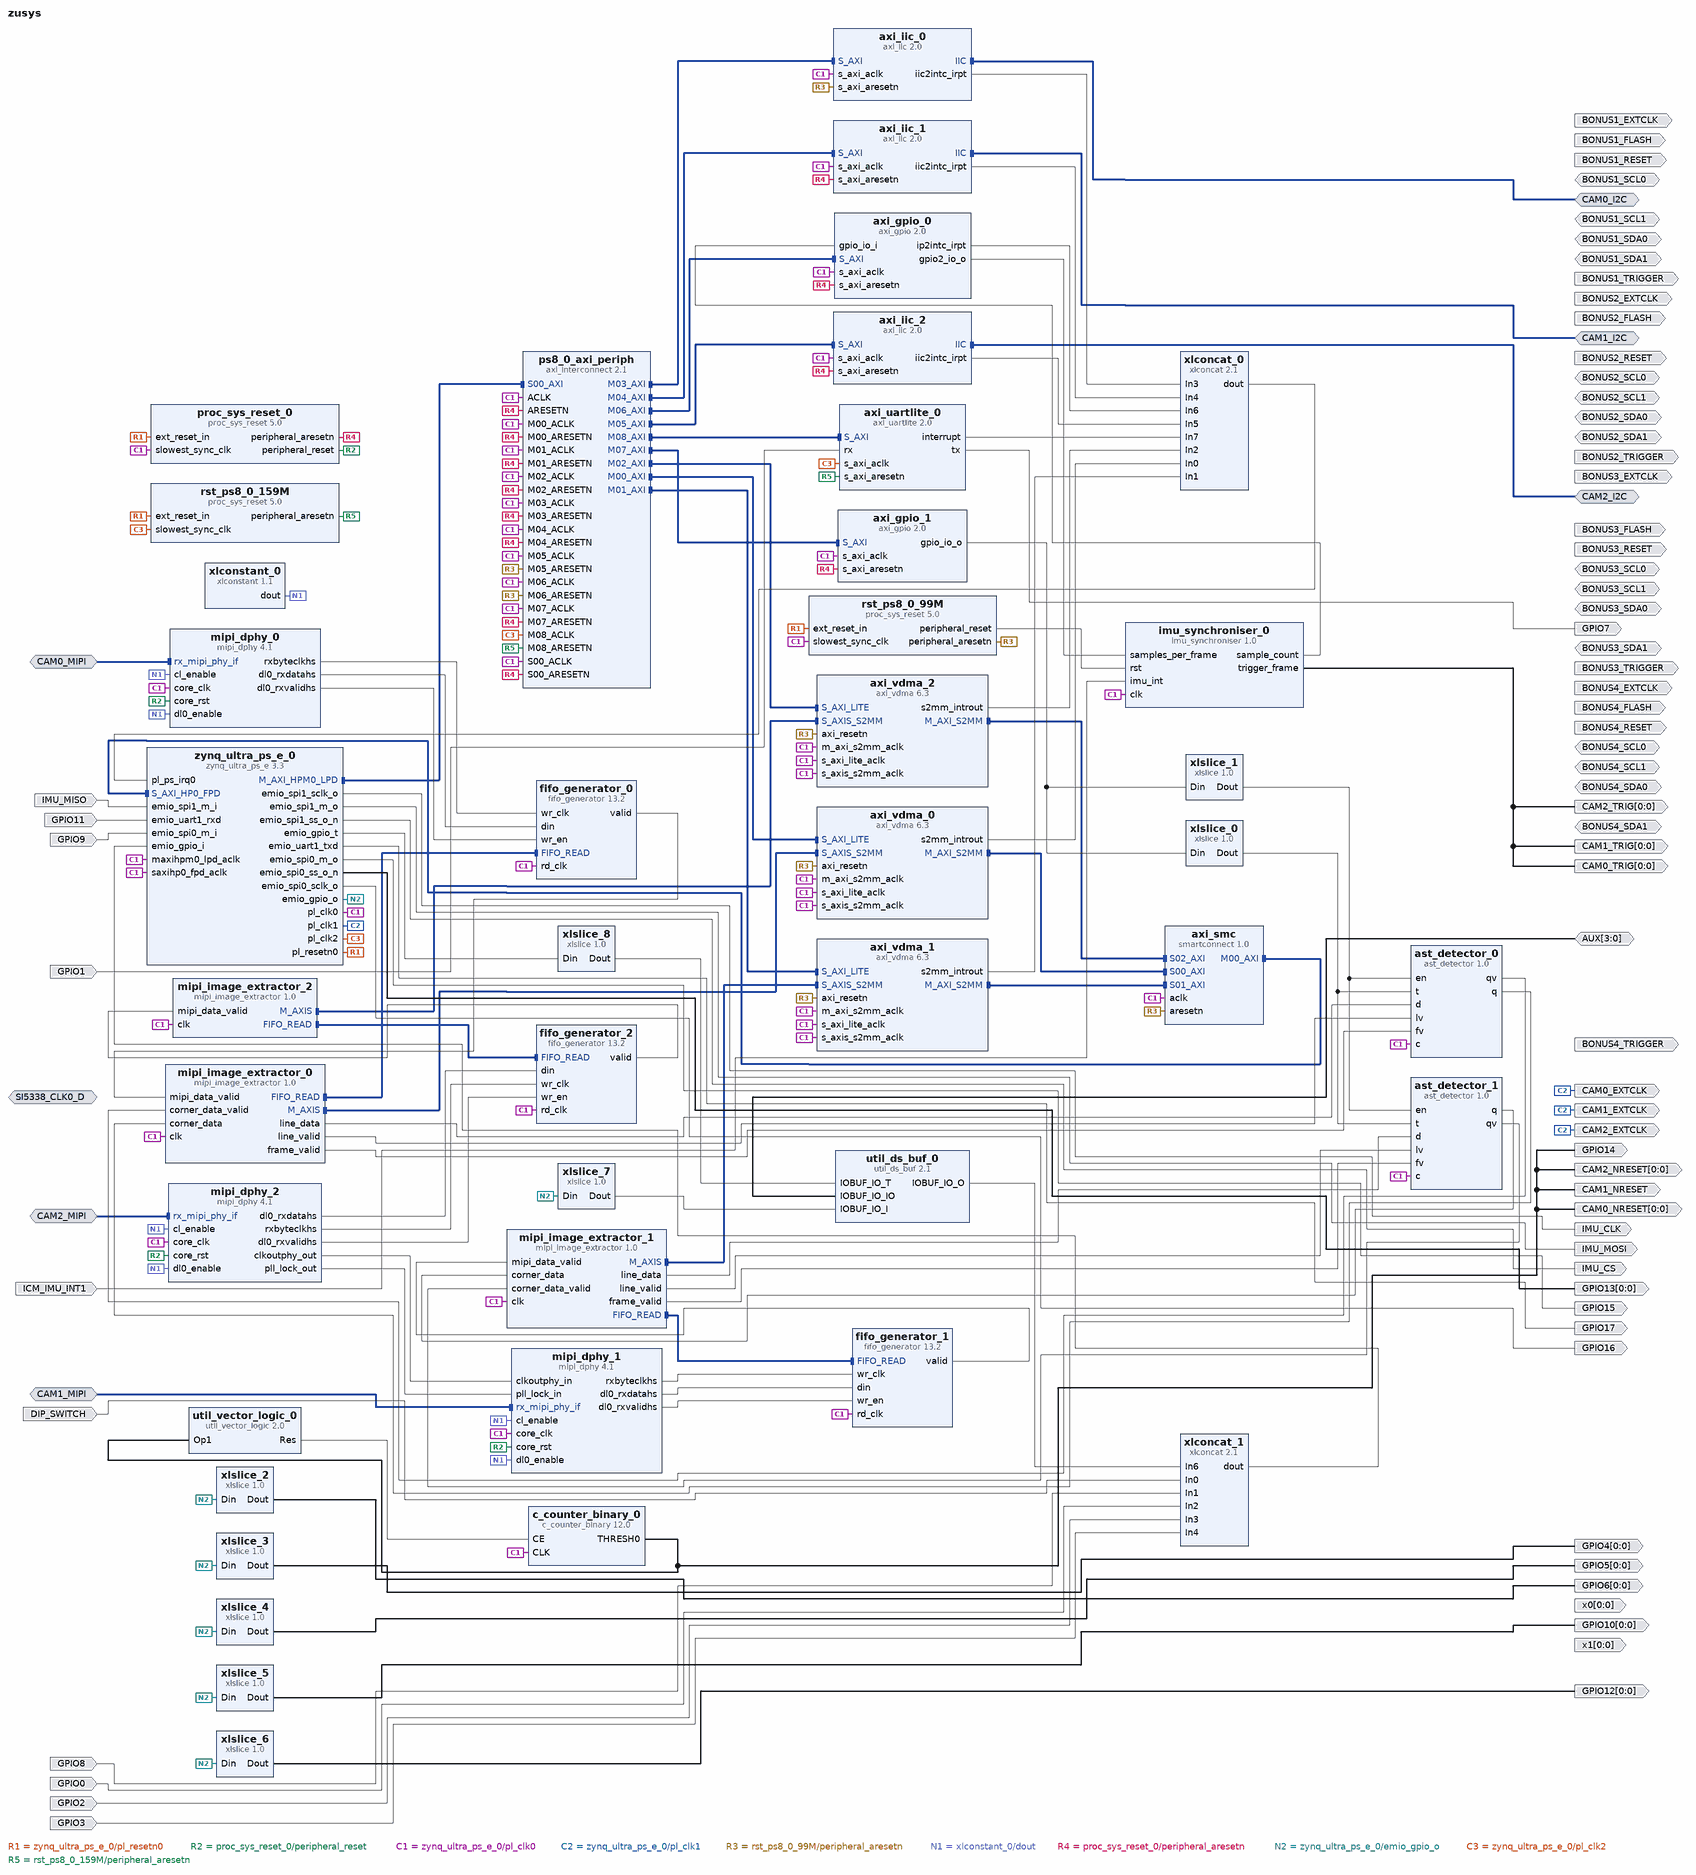
[diagram p0: block diagram of the top level]
# Vivado block design zusys, xczu3eg-sfvc784-1-e, Vivado 2019.1
create_bd_design zusys

create_bd_intf_port -mode Slave -vlnv xilinx.com:interface:diff_clock_rtl:1.0 SI5338_CLK0_D
create_bd_intf_port -mode Master -vlnv xilinx.com:interface:iic_rtl:1.0 CAM0_I2C
create_bd_intf_port -mode Master -vlnv xilinx.com:interface:iic_rtl:1.0 CAM1_I2C
create_bd_intf_port -mode Master -vlnv xilinx.com:interface:iic_rtl:1.0 CAM2_I2C
create_bd_intf_port -mode Slave -vlnv xilinx.com:interface:mipi_phy_rtl:1.0 CAM0_MIPI
create_bd_intf_port -mode Slave -vlnv xilinx.com:interface:mipi_phy_rtl:1.0 CAM1_MIPI
create_bd_intf_port -mode Slave -vlnv xilinx.com:interface:mipi_phy_rtl:1.0 CAM2_MIPI
create_bd_port -dir O -from 0 -to 0 CAM1_TRIG
create_bd_port -dir O CAM1_NRESET
create_bd_port -dir O CAM1_EXTCLK
create_bd_port -dir O -from 0 -to 0 CAM2_NRESET
create_bd_port -dir O CAM2_EXTCLK
create_bd_port -dir O -from 0 -to 0 CAM2_TRIG
create_bd_port -dir O BONUS2_TRIGGER
create_bd_port -dir O BONUS2_RESET
create_bd_port -dir O BONUS2_FLASH
create_bd_port -dir IO BONUS2_SDA1
create_bd_port -dir IO BONUS2_SCL1
create_bd_port -dir IO BONUS2_SDA0
create_bd_port -dir IO BONUS2_SCL0
create_bd_port -dir O BONUS2_EXTCLK
create_bd_port -dir O BONUS1_FLASH
create_bd_port -dir O BONUS1_RESET
create_bd_port -dir I ICM_IMU_INT1
create_bd_port -dir O BONUS1_TRIGGER
create_bd_port -dir O BONUS1_EXTCLK
create_bd_port -dir IO BONUS1_SCL0
create_bd_port -dir IO BONUS1_SDA0
create_bd_port -dir IO BONUS1_SCL1
create_bd_port -dir IO BONUS1_SDA1
create_bd_port -dir O BONUS4_RESET
create_bd_port -dir O BONUS4_TRIGGER
create_bd_port -dir O BONUS4_EXTCLK
create_bd_port -dir O CAM0_EXTCLK
create_bd_port -dir O -from 0 -to 0 CAM0_NRESET
create_bd_port -dir O -from 0 -to 0 CAM0_TRIG
create_bd_port -dir O BONUS3_EXTCLK
create_bd_port -dir IO BONUS3_SCL0
create_bd_port -dir IO BONUS3_SDA0
create_bd_port -dir IO BONUS3_SCL1
create_bd_port -dir IO BONUS3_SDA1
create_bd_port -dir O BONUS3_FLASH
create_bd_port -dir O BONUS3_RESET
create_bd_port -dir O BONUS3_TRIGGER
create_bd_port -dir O BONUS4_FLASH
create_bd_port -dir IO BONUS4_SDA0
create_bd_port -dir IO BONUS4_SDA1
create_bd_port -dir IO BONUS4_SCL0
create_bd_port -dir IO BONUS4_SCL1
create_bd_port -dir O -from 0 -to 0 GPIO4
create_bd_port -dir O -from 0 -to 0 GPIO5
create_bd_port -dir O -from 0 -to 0 GPIO6
create_bd_port -dir O GPIO7
create_bd_port -dir O -from 0 -to 0 GPIO10
create_bd_port -dir O -from 0 -to 0 GPIO12
create_bd_port -dir O -from 0 -to 0 GPIO13
create_bd_port -dir O GPIO14
create_bd_port -dir O GPIO15
create_bd_port -dir O GPIO16
create_bd_port -dir O GPIO17
create_bd_port -dir O IMU_MOSI
create_bd_port -dir O IMU_CS
create_bd_port -dir O IMU_CLK
create_bd_port -dir I IMU_MISO
create_bd_port -dir I DIP_SWITCH
create_bd_port -dir I GPIO8
create_bd_port -dir I GPIO9
create_bd_port -dir I GPIO11
create_bd_port -dir I GPIO0
create_bd_port -dir I GPIO1
create_bd_port -dir I GPIO2
create_bd_port -dir I GPIO3
create_bd_port -dir O -from 0 -to 0 x0
create_bd_port -dir O -from 0 -to 0 x1
create_bd_port -dir IO -from 3 -to 0 AUX

create_bd_cell -type ip -vlnv xilinx.com:ip:proc_sys_reset:5.0 rst_ps8_0_99M
create_bd_cell -type ip -vlnv xilinx.com:ip:proc_sys_reset:5.0 proc_sys_reset_0
create_bd_cell -type ip -vlnv xilinx.com:ip:util_vector_logic:2.0 util_vector_logic_0
set_property -dict {CONFIG.C_OPERATION not CONFIG.C_SIZE 1} [get_bd_cells util_vector_logic_0]
create_bd_cell -type ip -vlnv xilinx.com:ip:axi_gpio:2.0 axi_gpio_0
set_property -dict [list \
  CONFIG.C_ALL_INPUTS 1 \
  CONFIG.C_ALL_INPUTS_2 0 \
  CONFIG.C_ALL_OUTPUTS_2 1 \
  CONFIG.C_DOUT_DEFAULT_2 0x00000007 \
  CONFIG.C_GPIO2_WIDTH 8 \
  CONFIG.C_GPIO_WIDTH 8 \
  CONFIG.C_INTERRUPT_PRESENT 1 \
  CONFIG.C_IS_DUAL 1 \
] [get_bd_cells axi_gpio_0]
create_bd_cell -type ip -vlnv xilinx.com:ip:axi_iic:2.0 axi_iic_0
set_property -dict [list \
  CONFIG.C_SCL_INERTIAL_DELAY 20 \
  CONFIG.C_SDA_INERTIAL_DELAY 20 \
  CONFIG.IIC_FREQ_KHZ 400 \
] [get_bd_cells axi_iic_0]
create_bd_cell -type ip -vlnv xilinx.com:ip:axi_iic:2.0 axi_iic_1
set_property -dict [list \
  CONFIG.C_SCL_INERTIAL_DELAY 20 \
  CONFIG.C_SDA_INERTIAL_DELAY 20 \
  CONFIG.IIC_FREQ_KHZ 400 \
] [get_bd_cells axi_iic_1]
create_bd_cell -type ip -vlnv xilinx.com:ip:axi_iic:2.0 axi_iic_2
set_property -dict [list \
  CONFIG.C_SCL_INERTIAL_DELAY 20 \
  CONFIG.C_SDA_INERTIAL_DELAY 20 \
  CONFIG.IIC_FREQ_KHZ 400 \
] [get_bd_cells axi_iic_2]
create_bd_cell -type ip -vlnv xilinx.com:ip:smartconnect:1.0 axi_smc
set_property -dict {CONFIG.NUM_MI 1 CONFIG.NUM_SI 3} [get_bd_cells axi_smc]
create_bd_cell -type ip -vlnv xilinx.com:ip:axi_vdma:6.3 axi_vdma_0
set_property -dict [list \
  CONFIG.c_include_mm2s 0 \
  CONFIG.c_include_s2mm 1 \
  CONFIG.c_include_s2mm_dre 0 \
  CONFIG.c_num_fstores 3 \
  CONFIG.c_s2mm_genlock_mode 0 \
  CONFIG.c_s2mm_max_burst_length 8 \
  CONFIG.c_use_s2mm_fsync 0 \
] [get_bd_cells axi_vdma_0]
create_bd_cell -type ip -vlnv xilinx.com:ip:axi_vdma:6.3 axi_vdma_1
set_property -dict [list \
  CONFIG.c_include_mm2s 0 \
  CONFIG.c_include_s2mm 1 \
  CONFIG.c_include_s2mm_dre 0 \
  CONFIG.c_num_fstores 3 \
  CONFIG.c_s2mm_genlock_mode 0 \
  CONFIG.c_s2mm_max_burst_length 8 \
  CONFIG.c_use_s2mm_fsync 0 \
] [get_bd_cells axi_vdma_1]
create_bd_cell -type ip -vlnv xilinx.com:ip:axi_vdma:6.3 axi_vdma_2
set_property -dict [list \
  CONFIG.c_include_mm2s 0 \
  CONFIG.c_include_s2mm 1 \
  CONFIG.c_include_s2mm_dre 0 \
  CONFIG.c_num_fstores 3 \
  CONFIG.c_s2mm_genlock_mode 0 \
  CONFIG.c_s2mm_linebuffer_depth 128 \
  CONFIG.c_s2mm_max_burst_length 8 \
  CONFIG.c_use_s2mm_fsync 0 \
] [get_bd_cells axi_vdma_2]
create_bd_cell -type ip -vlnv xilinx.com:ip:c_counter_binary:12.0 c_counter_binary_0
set_property -dict [list \
  CONFIG.CE true \
  CONFIG.Final_Count_Value C3500 \
  CONFIG.Output_Width 20 \
  CONFIG.Restrict_Count true \
  CONFIG.Sync_Threshold_Output true \
  CONFIG.Threshold_Value C3500 \
] [get_bd_cells c_counter_binary_0]
create_bd_cell -type ip -vlnv xilinx.com:ip:fifo_generator:13.2 fifo_generator_0
set_property -dict [list \
  CONFIG.Fifo_Implementation Independent_Clocks_Distributed_RAM \
  CONFIG.Input_Data_Width 8 \
  CONFIG.Input_Depth 16 \
  CONFIG.Reset_Pin false \
  CONFIG.Valid_Flag true \
  CONFIG.synchronization_stages 3 \
] [get_bd_cells fifo_generator_0]
create_bd_cell -type ip -vlnv xilinx.com:ip:fifo_generator:13.2 fifo_generator_1
set_property -dict [list \
  CONFIG.Fifo_Implementation Independent_Clocks_Distributed_RAM \
  CONFIG.Input_Data_Width 8 \
  CONFIG.Input_Depth 16 \
  CONFIG.Reset_Pin false \
  CONFIG.Valid_Flag true \
  CONFIG.synchronization_stages 3 \
] [get_bd_cells fifo_generator_1]
create_bd_cell -type ip -vlnv xilinx.com:ip:fifo_generator:13.2 fifo_generator_2
set_property -dict [list \
  CONFIG.Fifo_Implementation Independent_Clocks_Distributed_RAM \
  CONFIG.Input_Data_Width 8 \
  CONFIG.Input_Depth 16 \
  CONFIG.Reset_Pin false \
  CONFIG.Valid_Flag true \
  CONFIG.synchronization_stages 3 \
] [get_bd_cells fifo_generator_2]
create_bd_cell -type ip -vlnv xilinx.com:ip:mipi_dphy:4.1 mipi_dphy_0
set_property -dict [list \
  CONFIG.CLK_LANE_IO_LOC AD5 \
  CONFIG.C_CLK_LANE_IO_POSITION 26 \
  CONFIG.C_DATA_LANE0_IO_POSITION 28 \
  CONFIG.C_DPHY_MODE SLAVE \
  CONFIG.C_EN_REG_IF false \
  CONFIG.C_HS_LINE_RATE 560 \
  CONFIG.C_HS_SETTLE_NS 152 \
  CONFIG.C_INIT 100000 \
  CONFIG.DATA_LANE0_IO_LOC AC4 \
  CONFIG.DATA_LANE0_TXIF2_BYTE All_Byte \
  CONFIG.DATA_LANE0_TXIF3_BYTE All_Byte \
  CONFIG.DATA_LANE0_TXIF4_BYTE All_Byte \
  CONFIG.SupportLevel 1 \
] [get_bd_cells mipi_dphy_0]
create_bd_cell -type ip -vlnv xilinx.com:ip:mipi_dphy:4.1 mipi_dphy_1
set_property -dict [list \
  CONFIG.CLK_LANE_IO_LOC G1 \
  CONFIG.C_CLK_LANE_IO_POSITION 0 \
  CONFIG.C_DATA_LANE0_IO_POSITION 2 \
  CONFIG.C_DPHY_MODE SLAVE \
  CONFIG.C_EN_REG_IF false \
  CONFIG.C_HS_LINE_RATE 560 \
  CONFIG.C_HS_SETTLE_NS 152 \
  CONFIG.C_INIT 100000 \
  CONFIG.C_TXIF1_INSTNAME tx66 \
  CONFIG.DATA_LANE0_IO_LOC E1 \
  CONFIG.DATA_LANE0_TXIF2_BYTE All_Byte \
  CONFIG.DATA_LANE0_TXIF3_BYTE All_Byte \
  CONFIG.DATA_LANE0_TXIF4_BYTE All_Byte \
  CONFIG.HP_IO_BANK_NAME {66_(HP)} \
  CONFIG.HP_IO_BANK_SELECTION 66 \
  CONFIG.SupportLevel 0 \
] [get_bd_cells mipi_dphy_1]
create_bd_cell -type ip -vlnv xilinx.com:ip:mipi_dphy:4.1 mipi_dphy_2
set_property -dict [list \
  CONFIG.CLK_LANE_IO_LOC B4 \
  CONFIG.C_CLK_LANE_IO_POSITION 19 \
  CONFIG.C_DATA_LANE0_IO_POSITION 21 \
  CONFIG.C_DPHY_MODE SLAVE \
  CONFIG.C_EN_REG_IF false \
  CONFIG.C_HS_LINE_RATE 560 \
  CONFIG.C_HS_SETTLE_NS 152 \
  CONFIG.C_INIT 100000 \
  CONFIG.C_TXIF1_INSTNAME tx66 \
  CONFIG.DATA_LANE0_IO_LOC D4 \
  CONFIG.DATA_LANE0_TXIF2_BYTE All_Byte \
  CONFIG.DATA_LANE0_TXIF3_BYTE All_Byte \
  CONFIG.DATA_LANE0_TXIF4_BYTE All_Byte \
  CONFIG.HP_IO_BANK_NAME {66_(HP)} \
  CONFIG.HP_IO_BANK_SELECTION 66 \
  CONFIG.SupportLevel 1 \
] [get_bd_cells mipi_dphy_2]
create_bd_cell -type ip -vlnv xilinx.com:ip:axi_interconnect:2.1 ps8_0_axi_periph
set_property -dict {CONFIG.NUM_MI 9} [get_bd_cells ps8_0_axi_periph]
create_bd_cell -type ip -vlnv xilinx.com:ip:xlconcat:2.1 xlconcat_0
set_property -dict {CONFIG.NUM_PORTS 8 CONFIG.dout_width 8} [get_bd_cells xlconcat_0]
create_bd_cell -type ip -vlnv xilinx.com:ip:xlconstant:1.1 xlconstant_0
create_bd_cell -type ip -vlnv xilinx.com:ip:zynq_ultra_ps_e:3.3 zynq_ultra_ps_e_0
set_property -dict [list \
  CONFIG.CAN0_BOARD_INTERFACE custom \
  CONFIG.CAN1_BOARD_INTERFACE custom \
  CONFIG.CSU_BOARD_INTERFACE custom \
  CONFIG.DP_BOARD_INTERFACE custom \
  CONFIG.GEM0_BOARD_INTERFACE custom \
  CONFIG.GEM1_BOARD_INTERFACE custom \
  CONFIG.GEM2_BOARD_INTERFACE custom \
  CONFIG.GEM3_BOARD_INTERFACE custom \
  CONFIG.GPIO_BOARD_INTERFACE custom \
  CONFIG.IIC0_BOARD_INTERFACE custom \
  CONFIG.IIC1_BOARD_INTERFACE custom \
  CONFIG.NAND_BOARD_INTERFACE custom \
  CONFIG.PCIE_BOARD_INTERFACE custom \
  CONFIG.PJTAG_BOARD_INTERFACE custom \
  CONFIG.PMU_BOARD_INTERFACE custom \
  CONFIG.PSU_BANK_0_IO_STANDARD LVCMOS18 \
  CONFIG.PSU_BANK_1_IO_STANDARD LVCMOS33 \
  CONFIG.PSU_BANK_2_IO_STANDARD LVCMOS18 \
  CONFIG.PSU_BANK_3_IO_STANDARD LVCMOS18 \
  CONFIG.PSU_USB3__DUAL_CLOCK_ENABLE 1 \
  CONFIG.PSU__CAN1__PERIPHERAL__ENABLE 0 \
  CONFIG.PSU__CRF_APB__ACPU_CTRL__FREQMHZ 1200 \
  CONFIG.PSU__CRF_APB__ACPU_CTRL__SRCSEL APLL \
  CONFIG.PSU__CRF_APB__APLL_CTRL__SRCSEL PSS_REF_CLK \
  CONFIG.PSU__CRF_APB__DBG_FPD_CTRL__FREQMHZ 250 \
  CONFIG.PSU__CRF_APB__DBG_FPD_CTRL__SRCSEL IOPLL \
  CONFIG.PSU__CRF_APB__DBG_TRACE_CTRL__FREQMHZ 250 \
  CONFIG.PSU__CRF_APB__DBG_TRACE_CTRL__SRCSEL IOPLL \
  CONFIG.PSU__CRF_APB__DBG_TSTMP_CTRL__FREQMHZ 250 \
  CONFIG.PSU__CRF_APB__DBG_TSTMP_CTRL__SRCSEL IOPLL \
  CONFIG.PSU__CRF_APB__DDR_CTRL__FREQMHZ 1200 \
  CONFIG.PSU__CRF_APB__DDR_CTRL__SRCSEL DPLL \
  CONFIG.PSU__CRF_APB__DPDMA_REF_CTRL__FREQMHZ 600 \
  CONFIG.PSU__CRF_APB__DPDMA_REF_CTRL__SRCSEL DPLL \
  CONFIG.PSU__CRF_APB__DPLL_CTRL__SRCSEL PSS_REF_CLK \
  CONFIG.PSU__CRF_APB__DP_AUDIO_REF_CTRL__SRCSEL VPLL \
  CONFIG.PSU__CRF_APB__DP_STC_REF_CTRL__SRCSEL VPLL \
  CONFIG.PSU__CRF_APB__DP_VIDEO_REF_CTRL__SRCSEL DPLL \
  CONFIG.PSU__CRF_APB__GDMA_REF_CTRL__FREQMHZ 600 \
  CONFIG.PSU__CRF_APB__GDMA_REF_CTRL__SRCSEL DPLL \
  CONFIG.PSU__CRF_APB__GPU_REF_CTRL__FREQMHZ 600 \
  CONFIG.PSU__CRF_APB__GPU_REF_CTRL__SRCSEL DPLL \
  CONFIG.PSU__CRF_APB__TOPSW_LSBUS_CTRL__FREQMHZ 100 \
  CONFIG.PSU__CRF_APB__TOPSW_LSBUS_CTRL__SRCSEL IOPLL \
  CONFIG.PSU__CRF_APB__TOPSW_MAIN_CTRL__FREQMHZ 533.333 \
  CONFIG.PSU__CRF_APB__TOPSW_MAIN_CTRL__SRCSEL VPLL \
  CONFIG.PSU__CRF_APB__VPLL_CTRL__SRCSEL PSS_REF_CLK \
  CONFIG.PSU__CRL_APB__ADMA_REF_CTRL__FREQMHZ 500 \
  CONFIG.PSU__CRL_APB__ADMA_REF_CTRL__SRCSEL IOPLL \
  CONFIG.PSU__CRL_APB__CAN1_REF_CTRL__FREQMHZ 100 \
  CONFIG.PSU__CRL_APB__CAN1_REF_CTRL__SRCSEL IOPLL \
  CONFIG.PSU__CRL_APB__CPU_R5_CTRL__FREQMHZ 500 \
  CONFIG.PSU__CRL_APB__CPU_R5_CTRL__SRCSEL IOPLL \
  CONFIG.PSU__CRL_APB__DBG_LPD_CTRL__FREQMHZ 250 \
  CONFIG.PSU__CRL_APB__DBG_LPD_CTRL__SRCSEL IOPLL \
  CONFIG.PSU__CRL_APB__GEM3_REF_CTRL__FREQMHZ 125 \
  CONFIG.PSU__CRL_APB__GEM3_REF_CTRL__SRCSEL IOPLL \
  CONFIG.PSU__CRL_APB__I2C0_REF_CTRL__FREQMHZ 100 \
  CONFIG.PSU__CRL_APB__I2C0_REF_CTRL__SRCSEL IOPLL \
  CONFIG.PSU__CRL_APB__I2C1_REF_CTRL__FREQMHZ 100 \
  CONFIG.PSU__CRL_APB__I2C1_REF_CTRL__SRCSEL IOPLL \
  CONFIG.PSU__CRL_APB__IOPLL_CTRL__SRCSEL PSS_REF_CLK \
  CONFIG.PSU__CRL_APB__IOU_SWITCH_CTRL__FREQMHZ 267 \
  CONFIG.PSU__CRL_APB__IOU_SWITCH_CTRL__SRCSEL RPLL \
  CONFIG.PSU__CRL_APB__LPD_LSBUS_CTRL__FREQMHZ 100 \
  CONFIG.PSU__CRL_APB__LPD_LSBUS_CTRL__SRCSEL IOPLL \
  CONFIG.PSU__CRL_APB__LPD_SWITCH_CTRL__FREQMHZ 500 \
  CONFIG.PSU__CRL_APB__LPD_SWITCH_CTRL__SRCSEL IOPLL \
  CONFIG.PSU__CRL_APB__PCAP_CTRL__FREQMHZ 200 \
  CONFIG.PSU__CRL_APB__PCAP_CTRL__SRCSEL IOPLL \
  CONFIG.PSU__CRL_APB__PL0_REF_CTRL__FREQMHZ 200 \
  CONFIG.PSU__CRL_APB__PL0_REF_CTRL__SRCSEL RPLL \
  CONFIG.PSU__CRL_APB__PL1_REF_CTRL__FREQMHZ 20 \
  CONFIG.PSU__CRL_APB__PL2_REF_CTRL__FREQMHZ 160 \
  CONFIG.PSU__CRL_APB__QSPI_REF_CTRL__FREQMHZ 300 \
  CONFIG.PSU__CRL_APB__QSPI_REF_CTRL__SRCSEL IOPLL \
  CONFIG.PSU__CRL_APB__RPLL_CTRL__SRCSEL PSS_REF_CLK \
  CONFIG.PSU__CRL_APB__SDIO1_REF_CTRL__FREQMHZ 200 \
  CONFIG.PSU__CRL_APB__SDIO1_REF_CTRL__SRCSEL RPLL \
  CONFIG.PSU__CRL_APB__TIMESTAMP_REF_CTRL__FREQMHZ 100 \
  CONFIG.PSU__CRL_APB__TIMESTAMP_REF_CTRL__SRCSEL PSS_REF_CLK \
  CONFIG.PSU__CRL_APB__UART0_REF_CTRL__FREQMHZ 100 \
  CONFIG.PSU__CRL_APB__UART0_REF_CTRL__SRCSEL IOPLL \
  CONFIG.PSU__CRL_APB__UART1_REF_CTRL__FREQMHZ 100 \
  CONFIG.PSU__CRL_APB__UART1_REF_CTRL__SRCSEL IOPLL \
  CONFIG.PSU__CRL_APB__USB0_BUS_REF_CTRL__FREQMHZ 250 \
  CONFIG.PSU__CRL_APB__USB0_BUS_REF_CTRL__SRCSEL IOPLL \
  CONFIG.PSU__CRL_APB__USB3_DUAL_REF_CTRL__FREQMHZ 20 \
  CONFIG.PSU__CRL_APB__USB3_DUAL_REF_CTRL__SRCSEL IOPLL \
  CONFIG.PSU__CRL_APB__USB3__ENABLE 1 \
  CONFIG.PSU__CSUPMU__PERIPHERAL__VALID 0 \
  CONFIG.PSU__DDRC__BUS_WIDTH {32 Bit} \
  CONFIG.PSU__DDRC__COMPONENTS Components \
  CONFIG.PSU__DDRC__DEVICE_CAPACITY {8192 MBits} \
  CONFIG.PSU__DDRC__DRAM_WIDTH {16 Bits} \
  CONFIG.PSU__DDRC__ECC Disabled \
  CONFIG.PSU__DDRC__MEMORY_TYPE {DDR 4} \
  CONFIG.PSU__DDRC__SPEED_BIN DDR4_2400P \
  CONFIG.PSU__DDR_HIGH_ADDRESS_GUI_ENABLE 0 \
  CONFIG.PSU__DDR__INTERFACE__FREQMHZ 600.000 \
  CONFIG.PSU__DEVICE_TYPE EG \
  CONFIG.PSU__DISPLAYPORT__PERIPHERAL__ENABLE 0 \
  CONFIG.PSU__DLL__ISUSED 1 \
  CONFIG.PSU__ENET3__FIFO__ENABLE 0 \
  CONFIG.PSU__ENET3__GRP_MDIO__ENABLE 1 \
  CONFIG.PSU__ENET3__GRP_MDIO__IO {MIO 76 .. 77} \
  CONFIG.PSU__ENET3__PERIPHERAL__ENABLE 1 \
  CONFIG.PSU__ENET3__PERIPHERAL__IO {MIO 64 .. 75} \
  CONFIG.PSU__ENET3__PTP__ENABLE 0 \
  CONFIG.PSU__ENET3__TSU__ENABLE 0 \
  CONFIG.PSU__FPGA_PL0_ENABLE 1 \
  CONFIG.PSU__FPGA_PL1_ENABLE 1 \
  CONFIG.PSU__FPGA_PL2_ENABLE 1 \
  CONFIG.PSU__GEM3_COHERENCY 0 \
  CONFIG.PSU__GEM3_ROUTE_THROUGH_FPD 0 \
  CONFIG.PSU__GEM__TSU__ENABLE 0 \
  CONFIG.PSU__GPIO0_MIO__PERIPHERAL__ENABLE 0 \
  CONFIG.PSU__GPIO1_MIO__IO {MIO 26 .. 51} \
  CONFIG.PSU__GPIO1_MIO__PERIPHERAL__ENABLE 1 \
  CONFIG.PSU__GPIO_EMIO_WIDTH 14 \
  CONFIG.PSU__GPIO_EMIO__PERIPHERAL__ENABLE 1 \
  CONFIG.PSU__GPIO_EMIO__PERIPHERAL__IO 14 \
  CONFIG.PSU__I2C0__PERIPHERAL__ENABLE 1 \
  CONFIG.PSU__I2C0__PERIPHERAL__IO {MIO 38 .. 39} \
  CONFIG.PSU__I2C1__PERIPHERAL__ENABLE 1 \
  CONFIG.PSU__I2C1__PERIPHERAL__IO {MIO 32 .. 33} \
  CONFIG.PSU__IOU_SLCR__IOU_TTC_APB_CLK__TTC0_SEL APB \
  CONFIG.PSU__IOU_SLCR__IOU_TTC_APB_CLK__TTC1_SEL APB \
  CONFIG.PSU__IOU_SLCR__IOU_TTC_APB_CLK__TTC2_SEL APB \
  CONFIG.PSU__IOU_SLCR__IOU_TTC_APB_CLK__TTC3_SEL APB \
  CONFIG.PSU__LPD_SLCR__CSUPMU__FREQMHZ 100 \
  CONFIG.PSU__OVERRIDE__BASIC_CLOCK 0 \
  CONFIG.PSU__PMU__PERIPHERAL__ENABLE 0 \
  CONFIG.PSU__PRESET_APPLIED 1 \
  CONFIG.PSU__PSS_REF_CLK__FREQMHZ 33.33333 \
  CONFIG.PSU__QSPI_COHERENCY 0 \
  CONFIG.PSU__QSPI_ROUTE_THROUGH_FPD 0 \
  CONFIG.PSU__QSPI__GRP_FBCLK__ENABLE 1 \
  CONFIG.PSU__QSPI__GRP_FBCLK__IO {MIO 6} \
  CONFIG.PSU__QSPI__PERIPHERAL__DATA_MODE x4 \
  CONFIG.PSU__QSPI__PERIPHERAL__ENABLE 1 \
  CONFIG.PSU__QSPI__PERIPHERAL__IO {MIO 0 .. 12} \
  CONFIG.PSU__QSPI__PERIPHERAL__MODE {Dual Parallel} \
  CONFIG.PSU__SATA__PERIPHERAL__ENABLE 0 \
  CONFIG.PSU__SD0__DATA_TRANSFER_MODE 8Bit \
  CONFIG.PSU__SD0__GRP_POW__ENABLE 1 \
  CONFIG.PSU__SD0__GRP_POW__IO {MIO 23} \
  CONFIG.PSU__SD0__PERIPHERAL__ENABLE 1 \
  CONFIG.PSU__SD0__PERIPHERAL__IO {MIO 13 .. 22} \
  CONFIG.PSU__SD0__RESET__ENABLE 1 \
  CONFIG.PSU__SD0__SLOT_TYPE eMMC \
  CONFIG.PSU__SD1_COHERENCY 0 \
  CONFIG.PSU__SD1_ROUTE_THROUGH_FPD 0 \
  CONFIG.PSU__SD1__DATA_TRANSFER_MODE 4Bit \
  CONFIG.PSU__SD1__GRP_CD__ENABLE 0 \
  CONFIG.PSU__SD1__GRP_POW__ENABLE 0 \
  CONFIG.PSU__SD1__GRP_WP__ENABLE 0 \
  CONFIG.PSU__SD1__PERIPHERAL__ENABLE 1 \
  CONFIG.PSU__SD1__PERIPHERAL__IO {MIO 46 .. 51} \
  CONFIG.PSU__SD1__SLOT_TYPE {SD 2.0} \
  CONFIG.PSU__SPI0__GRP_SS0__IO EMIO \
  CONFIG.PSU__SPI0__PERIPHERAL__ENABLE 1 \
  CONFIG.PSU__SPI0__PERIPHERAL__IO EMIO \
  CONFIG.PSU__SPI1__GRP_SS0__IO EMIO \
  CONFIG.PSU__SPI1__PERIPHERAL__ENABLE 1 \
  CONFIG.PSU__SPI1__PERIPHERAL__IO EMIO \
  CONFIG.PSU__SWDT0__CLOCK__ENABLE 0 \
  CONFIG.PSU__SWDT0__PERIPHERAL__ENABLE 1 \
  CONFIG.PSU__SWDT0__RESET__ENABLE 0 \
  CONFIG.PSU__SWDT1__CLOCK__ENABLE 0 \
  CONFIG.PSU__SWDT1__PERIPHERAL__ENABLE 1 \
  CONFIG.PSU__SWDT1__RESET__ENABLE 0 \
  CONFIG.PSU__TSU__BUFG_PORT_PAIR 0 \
  CONFIG.PSU__TTC0__CLOCK__ENABLE 0 \
  CONFIG.PSU__TTC0__PERIPHERAL__ENABLE 1 \
  CONFIG.PSU__TTC0__WAVEOUT__ENABLE 0 \
  CONFIG.PSU__TTC1__CLOCK__ENABLE 0 \
  CONFIG.PSU__TTC1__PERIPHERAL__ENABLE 1 \
  CONFIG.PSU__TTC1__WAVEOUT__ENABLE 0 \
  CONFIG.PSU__TTC2__CLOCK__ENABLE 0 \
  CONFIG.PSU__TTC2__PERIPHERAL__ENABLE 1 \
  CONFIG.PSU__TTC2__WAVEOUT__ENABLE 0 \
  CONFIG.PSU__TTC3__CLOCK__ENABLE 0 \
  CONFIG.PSU__TTC3__PERIPHERAL__ENABLE 1 \
  CONFIG.PSU__TTC3__WAVEOUT__ENABLE 0 \
  CONFIG.PSU__UART0__BAUD_RATE 115200 \
  CONFIG.PSU__UART0__MODEM__ENABLE 0 \
  CONFIG.PSU__UART0__PERIPHERAL__ENABLE 1 \
  CONFIG.PSU__UART0__PERIPHERAL__IO {MIO 30 .. 31} \
  CONFIG.PSU__UART1__BAUD_RATE 921600 \
  CONFIG.PSU__UART1__MODEM__ENABLE 0 \
  CONFIG.PSU__UART1__PERIPHERAL__ENABLE 1 \
  CONFIG.PSU__UART1__PERIPHERAL__IO EMIO \
  CONFIG.PSU__USB0_COHERENCY 0 \
  CONFIG.PSU__USB0__PERIPHERAL__ENABLE 1 \
  CONFIG.PSU__USB0__PERIPHERAL__IO {MIO 52 .. 63} \
  CONFIG.PSU__USB0__REF_CLK_FREQ 100 \
  CONFIG.PSU__USB0__REF_CLK_SEL {Ref Clk3} \
  CONFIG.PSU__USB2_0__EMIO__ENABLE 0 \
  CONFIG.PSU__USB3_0__EMIO__ENABLE 0 \
  CONFIG.PSU__USB3_0__PERIPHERAL__ENABLE 1 \
  CONFIG.PSU__USB3_0__PERIPHERAL__IO {GT Lane1} \
  CONFIG.PSU__USB__RESET__MODE {Boot Pin} \
  CONFIG.PSU__USB__RESET__POLARITY {Active Low} \
  CONFIG.PSU__USE__IRQ0 1 \
  CONFIG.PSU__USE__M_AXI_GP0 0 \
  CONFIG.PSU__USE__M_AXI_GP1 0 \
  CONFIG.PSU__USE__M_AXI_GP2 1 \
  CONFIG.PSU__USE__S_AXI_GP2 1 \
  CONFIG.QSPI_BOARD_INTERFACE custom \
  CONFIG.SATA_BOARD_INTERFACE custom \
  CONFIG.SD0_BOARD_INTERFACE custom \
  CONFIG.SD1_BOARD_INTERFACE custom \
  CONFIG.SPI0_BOARD_INTERFACE custom \
  CONFIG.SPI1_BOARD_INTERFACE custom \
  CONFIG.SUBPRESET1 Custom \
  CONFIG.SUBPRESET2 Custom \
  CONFIG.SWDT0_BOARD_INTERFACE custom \
  CONFIG.SWDT1_BOARD_INTERFACE custom \
  CONFIG.TRACE_BOARD_INTERFACE custom \
  CONFIG.TTC0_BOARD_INTERFACE custom \
  CONFIG.TTC1_BOARD_INTERFACE custom \
  CONFIG.TTC2_BOARD_INTERFACE custom \
  CONFIG.TTC3_BOARD_INTERFACE custom \
  CONFIG.UART0_BOARD_INTERFACE custom \
  CONFIG.UART1_BOARD_INTERFACE custom \
  CONFIG.USB0_BOARD_INTERFACE custom \
  CONFIG.USB1_BOARD_INTERFACE custom \
] [get_bd_cells zynq_ultra_ps_e_0]
# 751 more settings of zynq_ultra_ps_e_0 are not shown: defaults, MIO pin electricals, DDR timing, and values the tool derives
create_bd_cell -type ip -vlnv xilinx.com:ip:axi_gpio:2.0 axi_gpio_1
set_property -dict {CONFIG.C_ALL_INPUTS 0 CONFIG.C_ALL_OUTPUTS 1 CONFIG.C_GPIO_WIDTH 9} [get_bd_cells axi_gpio_1]
create_bd_cell -type ip -vlnv xilinx.com:ip:xlslice:1.0 xlslice_0
set_property -dict {CONFIG.DIN_FROM 7 CONFIG.DIN_TO 0 CONFIG.DIN_WIDTH 9 CONFIG.DOUT_WIDTH 8} [get_bd_cells xlslice_0]
create_bd_cell -type ip -vlnv xilinx.com:ip:xlslice:1.0 xlslice_1
set_property -dict {CONFIG.DIN_FROM 8 CONFIG.DIN_TO 8 CONFIG.DIN_WIDTH 9 CONFIG.DOUT_WIDTH 1} [get_bd_cells xlslice_1]
create_bd_cell -type ip -vlnv user.org:user:ast_detector:1.0 ast_detector_0
set_property -dict {CONFIG.MAX_QV 1250} [get_bd_cells ast_detector_0]
create_bd_cell -type ip -vlnv user.org:user:ast_detector:1.0 ast_detector_1
set_property -dict {CONFIG.MAX_QV 1250} [get_bd_cells ast_detector_1]
create_bd_cell -type ip -vlnv user.org:user:imu_synchroniser:1.0 imu_synchroniser_0
create_bd_cell -type ip -vlnv xilinx.com:ip:xlconcat:2.1 xlconcat_1
set_property -dict {CONFIG.IN5_WIDTH 5 CONFIG.IN6_WIDTH 4 CONFIG.NUM_PORTS 7} [get_bd_cells xlconcat_1]
create_bd_cell -type ip -vlnv xilinx.com:ip:axi_uartlite:2.0 axi_uartlite_0
set_property -dict {CONFIG.C_BAUDRATE 921600} [get_bd_cells axi_uartlite_0]
create_bd_cell -type ip -vlnv xilinx.com:ip:xlslice:1.0 xlslice_2
set_property -dict {CONFIG.DIN_FROM 5 CONFIG.DIN_TO 5 CONFIG.DIN_WIDTH 14 CONFIG.DOUT_WIDTH 1} [get_bd_cells xlslice_2]
create_bd_cell -type ip -vlnv xilinx.com:ip:proc_sys_reset:5.0 rst_ps8_0_159M
create_bd_cell -type ip -vlnv xilinx.com:ip:xlslice:1.0 xlslice_3
set_property -dict {CONFIG.DIN_FROM 6 CONFIG.DIN_TO 6 CONFIG.DIN_WIDTH 14 CONFIG.DOUT_WIDTH 1} [get_bd_cells xlslice_3]
create_bd_cell -type ip -vlnv xilinx.com:ip:xlslice:1.0 xlslice_4
set_property -dict {CONFIG.DIN_FROM 7 CONFIG.DIN_TO 7 CONFIG.DIN_WIDTH 14 CONFIG.DOUT_WIDTH 1} [get_bd_cells xlslice_4]
create_bd_cell -type ip -vlnv xilinx.com:ip:xlslice:1.0 xlslice_5
set_property -dict {CONFIG.DIN_FROM 8 CONFIG.DIN_TO 8 CONFIG.DIN_WIDTH 14 CONFIG.DOUT_WIDTH 1} [get_bd_cells xlslice_5]
create_bd_cell -type ip -vlnv xilinx.com:ip:xlslice:1.0 xlslice_6
set_property -dict {CONFIG.DIN_FROM 9 CONFIG.DIN_TO 9 CONFIG.DIN_WIDTH 14 CONFIG.DOUT_WIDTH 1} [get_bd_cells xlslice_6]
create_bd_cell -type ip -vlnv user.org:user:mipi_image_extractor:1.0 mipi_image_extractor_0
create_bd_cell -type ip -vlnv user.org:user:mipi_image_extractor:1.0 mipi_image_extractor_1
create_bd_cell -type ip -vlnv user.org:user:mipi_image_extractor:1.0 mipi_image_extractor_2
create_bd_cell -type ip -vlnv xilinx.com:ip:util_ds_buf:2.1 util_ds_buf_0
set_property -dict {CONFIG.C_BUF_TYPE IOBUF CONFIG.C_SIZE 4} [get_bd_cells util_ds_buf_0]
create_bd_cell -type ip -vlnv xilinx.com:ip:xlslice:1.0 xlslice_7
set_property -dict {CONFIG.DIN_FROM 13 CONFIG.DIN_TO 10 CONFIG.DIN_WIDTH 14 CONFIG.DOUT_WIDTH 4} [get_bd_cells xlslice_7]
create_bd_cell -type ip -vlnv xilinx.com:ip:xlslice:1.0 xlslice_8
set_property -dict {CONFIG.DIN_FROM 13 CONFIG.DIN_TO 10 CONFIG.DIN_WIDTH 14 CONFIG.DOUT_WIDTH 4} [get_bd_cells xlslice_8]

# ---- connections ----

connect_bd_intf_net [get_bd_intf_pins mipi_image_extractor_0/FIFO_READ] [get_bd_intf_pins fifo_generator_0/FIFO_READ]
connect_bd_intf_net [get_bd_intf_pins mipi_image_extractor_2/M_AXIS] [get_bd_intf_pins axi_vdma_2/S_AXIS_S2MM]
connect_bd_intf_net [get_bd_intf_pins ps8_0_axi_periph/M06_AXI] [get_bd_intf_pins axi_gpio_0/S_AXI]
connect_bd_intf_net [get_bd_intf_pins ps8_0_axi_periph/M04_AXI] [get_bd_intf_pins axi_iic_1/S_AXI]
connect_bd_intf_net [get_bd_intf_pins mipi_image_extractor_1/M_AXIS] [get_bd_intf_pins axi_vdma_1/S_AXIS_S2MM]
connect_bd_intf_net [get_bd_intf_pins ps8_0_axi_periph/M00_AXI] [get_bd_intf_pins axi_vdma_0/S_AXI_LITE]
connect_bd_intf_net [get_bd_intf_pins ps8_0_axi_periph/M02_AXI] [get_bd_intf_pins axi_vdma_2/S_AXI_LITE]
connect_bd_intf_net [get_bd_intf_pins zynq_ultra_ps_e_0/M_AXI_HPM0_LPD] [get_bd_intf_pins ps8_0_axi_periph/S00_AXI]
connect_bd_intf_net [get_bd_intf_ports CAM2_I2C] [get_bd_intf_pins axi_iic_2/IIC]
connect_bd_intf_net [get_bd_intf_ports CAM1_I2C] [get_bd_intf_pins axi_iic_1/IIC]
connect_bd_intf_net [get_bd_intf_pins mipi_image_extractor_1/FIFO_READ] [get_bd_intf_pins fifo_generator_1/FIFO_READ]
connect_bd_intf_net [get_bd_intf_pins axi_smc/M00_AXI] [get_bd_intf_pins zynq_ultra_ps_e_0/S_AXI_HP0_FPD]
connect_bd_intf_net [get_bd_intf_pins ps8_0_axi_periph/M05_AXI] [get_bd_intf_pins axi_iic_2/S_AXI]
connect_bd_intf_net [get_bd_intf_pins mipi_image_extractor_2/FIFO_READ] [get_bd_intf_pins fifo_generator_2/FIFO_READ]
connect_bd_intf_net [get_bd_intf_pins ps8_0_axi_periph/M01_AXI] [get_bd_intf_pins axi_vdma_1/S_AXI_LITE]
connect_bd_intf_net [get_bd_intf_ports CAM0_I2C] [get_bd_intf_pins axi_iic_0/IIC]
connect_bd_intf_net -intf_net rx_mipi_phy_if_1_1 [get_bd_intf_ports CAM2_MIPI] [get_bd_intf_pins mipi_dphy_2/rx_mipi_phy_if]
connect_bd_intf_net [get_bd_intf_pins axi_vdma_2/M_AXI_S2MM] [get_bd_intf_pins axi_smc/S02_AXI]
connect_bd_intf_net -intf_net rx_mipi_phy_if_0_2 [get_bd_intf_ports CAM1_MIPI] [get_bd_intf_pins mipi_dphy_1/rx_mipi_phy_if]
connect_bd_intf_net [get_bd_intf_pins axi_vdma_0/M_AXI_S2MM] [get_bd_intf_pins axi_smc/S00_AXI]
connect_bd_intf_net [get_bd_intf_pins mipi_image_extractor_0/M_AXIS] [get_bd_intf_pins axi_vdma_0/S_AXIS_S2MM]
connect_bd_intf_net -intf_net rx_mipi_phy_if_0_1 [get_bd_intf_ports CAM0_MIPI] [get_bd_intf_pins mipi_dphy_0/rx_mipi_phy_if]
connect_bd_intf_net [get_bd_intf_pins axi_smc/S01_AXI] [get_bd_intf_pins axi_vdma_1/M_AXI_S2MM]
connect_bd_intf_net [get_bd_intf_pins ps8_0_axi_periph/M07_AXI] [get_bd_intf_pins axi_gpio_1/S_AXI]
connect_bd_intf_net [get_bd_intf_pins ps8_0_axi_periph/M03_AXI] [get_bd_intf_pins axi_iic_0/S_AXI]
connect_bd_intf_net [get_bd_intf_pins ps8_0_axi_periph/M08_AXI] [get_bd_intf_pins axi_uartlite_0/S_AXI]
connect_bd_net [get_bd_pins zynq_ultra_ps_e_0/pl_resetn0] \
  [get_bd_pins rst_ps8_0_99M/ext_reset_in] [get_bd_pins proc_sys_reset_0/ext_reset_in] \
  [get_bd_pins rst_ps8_0_159M/ext_reset_in]
connect_bd_net -net rst_ps8_0_99M_peripheral_reset [get_bd_pins proc_sys_reset_0/peripheral_reset] \
  [get_bd_pins mipi_dphy_0/core_rst] [get_bd_pins mipi_dphy_1/core_rst] [get_bd_pins mipi_dphy_2/core_rst]
connect_bd_net [get_bd_pins axi_vdma_0/s2mm_introut] [get_bd_pins xlconcat_0/In0]
connect_bd_net [get_bd_pins axi_vdma_2/s2mm_introut] [get_bd_pins xlconcat_0/In2]
connect_bd_net [get_bd_pins axi_vdma_1/s2mm_introut] [get_bd_pins xlconcat_0/In1]
connect_bd_net [get_bd_pins xlconcat_0/dout] [get_bd_pins zynq_ultra_ps_e_0/pl_ps_irq0]
connect_bd_net [get_bd_pins zynq_ultra_ps_e_0/pl_clk0] \
  [get_bd_pins rst_ps8_0_99M/slowest_sync_clk] [get_bd_pins proc_sys_reset_0/slowest_sync_clk] \
  [get_bd_pins axi_gpio_0/s_axi_aclk] [get_bd_pins axi_iic_0/s_axi_aclk] [get_bd_pins axi_iic_1/s_axi_aclk] \
  [get_bd_pins axi_iic_2/s_axi_aclk] [get_bd_pins axi_smc/aclk] [get_bd_pins axi_vdma_0/s_axi_lite_aclk] \
  [get_bd_pins axi_vdma_0/m_axi_s2mm_aclk] [get_bd_pins axi_vdma_0/s_axis_s2mm_aclk] [get_bd_pins axi_vdma_1/s_axi_lite_aclk] \
  [get_bd_pins axi_vdma_1/m_axi_s2mm_aclk] [get_bd_pins axi_vdma_1/s_axis_s2mm_aclk] [get_bd_pins axi_vdma_2/s_axi_lite_aclk] \
  [get_bd_pins axi_vdma_2/m_axi_s2mm_aclk] [get_bd_pins axi_vdma_2/s_axis_s2mm_aclk] [get_bd_pins c_counter_binary_0/CLK] \
  [get_bd_pins fifo_generator_0/rd_clk] [get_bd_pins fifo_generator_1/rd_clk] [get_bd_pins fifo_generator_2/rd_clk] \
  [get_bd_pins mipi_dphy_0/core_clk] [get_bd_pins mipi_dphy_1/core_clk] [get_bd_pins mipi_dphy_2/core_clk] \
  [get_bd_pins ps8_0_axi_periph/ACLK] [get_bd_pins ps8_0_axi_periph/S00_ACLK] [get_bd_pins ps8_0_axi_periph/M00_ACLK] \
  [get_bd_pins ps8_0_axi_periph/M01_ACLK] [get_bd_pins ps8_0_axi_periph/M02_ACLK] [get_bd_pins ps8_0_axi_periph/M03_ACLK] \
  [get_bd_pins ps8_0_axi_periph/M04_ACLK] [get_bd_pins ps8_0_axi_periph/M05_ACLK] [get_bd_pins ps8_0_axi_periph/M06_ACLK] \
  [get_bd_pins zynq_ultra_ps_e_0/maxihpm0_lpd_aclk] [get_bd_pins zynq_ultra_ps_e_0/saxihp0_fpd_aclk] \
  [get_bd_pins axi_gpio_1/s_axi_aclk] [get_bd_pins ps8_0_axi_periph/M07_ACLK] [get_bd_pins ast_detector_0/c] \
  [get_bd_pins ast_detector_1/c] [get_bd_pins imu_synchroniser_0/clk] [get_bd_pins mipi_image_extractor_0/clk] \
  [get_bd_pins mipi_image_extractor_1/clk] [get_bd_pins mipi_image_extractor_2/clk]
connect_bd_net [get_bd_pins axi_iic_0/iic2intc_irpt] [get_bd_pins xlconcat_0/In3]
connect_bd_net [get_bd_pins zynq_ultra_ps_e_0/pl_clk1] [get_bd_ports CAM2_EXTCLK] [get_bd_ports CAM0_EXTCLK] [get_bd_ports CAM1_EXTCLK]
connect_bd_net [get_bd_pins rst_ps8_0_99M/peripheral_aresetn] \
  [get_bd_pins axi_iic_0/s_axi_aresetn] [get_bd_pins axi_smc/aresetn] [get_bd_pins axi_vdma_0/axi_resetn] \
  [get_bd_pins axi_vdma_1/axi_resetn] [get_bd_pins axi_vdma_2/axi_resetn] [get_bd_pins ps8_0_axi_periph/M05_ARESETN] \
  [get_bd_pins ps8_0_axi_periph/M06_ARESETN]
connect_bd_net [get_bd_pins xlconstant_0/dout] \
  [get_bd_pins mipi_dphy_0/cl_enable] [get_bd_pins mipi_dphy_0/dl0_enable] [get_bd_pins mipi_dphy_1/cl_enable] \
  [get_bd_pins mipi_dphy_1/dl0_enable] [get_bd_pins mipi_dphy_2/cl_enable] [get_bd_pins mipi_dphy_2/dl0_enable]
connect_bd_net [get_bd_pins proc_sys_reset_0/peripheral_aresetn] \
  [get_bd_pins axi_gpio_0/s_axi_aresetn] [get_bd_pins axi_iic_1/s_axi_aresetn] [get_bd_pins axi_iic_2/s_axi_aresetn] \
  [get_bd_pins ps8_0_axi_periph/ARESETN] [get_bd_pins ps8_0_axi_periph/S00_ARESETN] \
  [get_bd_pins ps8_0_axi_periph/M00_ARESETN] [get_bd_pins ps8_0_axi_periph/M01_ARESETN] \
  [get_bd_pins ps8_0_axi_periph/M02_ARESETN] [get_bd_pins ps8_0_axi_periph/M03_ARESETN] \
  [get_bd_pins ps8_0_axi_periph/M04_ARESETN] [get_bd_pins axi_gpio_1/s_axi_aresetn] \
  [get_bd_pins ps8_0_axi_periph/M07_ARESETN]
connect_bd_net [get_bd_pins c_counter_binary_0/THRESH0] \
  [get_bd_pins util_vector_logic_0/Op1] [get_bd_ports CAM2_NRESET] [get_bd_ports CAM0_NRESET] [get_bd_ports CAM1_NRESET] \
  [get_bd_ports GPIO14]
connect_bd_net [get_bd_pins util_vector_logic_0/Res] [get_bd_pins c_counter_binary_0/CE]
connect_bd_net [get_bd_pins axi_iic_1/iic2intc_irpt] [get_bd_pins xlconcat_0/In4]
connect_bd_net [get_bd_pins rst_ps8_0_99M/peripheral_reset] [get_bd_pins imu_synchroniser_0/rst]
connect_bd_net [get_bd_pins mipi_dphy_2/dl0_rxdatahs] [get_bd_pins fifo_generator_2/din]
connect_bd_net [get_bd_pins mipi_dphy_2/clkoutphy_out] [get_bd_pins mipi_dphy_1/clkoutphy_in]
connect_bd_net [get_bd_pins mipi_dphy_2/pll_lock_out] [get_bd_pins mipi_dphy_1/pll_lock_in]
connect_bd_net [get_bd_pins axi_iic_2/iic2intc_irpt] [get_bd_pins xlconcat_0/In5]
connect_bd_net [get_bd_pins zynq_ultra_ps_e_0/emio_spi1_sclk_o] [get_bd_ports IMU_CLK]
connect_bd_net [get_bd_pins zynq_ultra_ps_e_0/emio_spi1_m_o] [get_bd_ports IMU_MOSI]
connect_bd_net [get_bd_pins zynq_ultra_ps_e_0/emio_spi1_ss_o_n] [get_bd_ports IMU_CS]
connect_bd_net [get_bd_ports IMU_MISO] [get_bd_pins zynq_ultra_ps_e_0/emio_spi1_m_i]
connect_bd_net [get_bd_pins axi_gpio_0/ip2intc_irpt] [get_bd_pins xlconcat_0/In6]
connect_bd_net -net ICM_IMU_INT1_1 [get_bd_ports ICM_IMU_INT1] [get_bd_pins imu_synchroniser_0/imu_int]
connect_bd_net [get_bd_pins axi_gpio_0/gpio2_io_o] [get_bd_pins imu_synchroniser_0/samples_per_frame]
connect_bd_net [get_bd_pins imu_synchroniser_0/trigger_frame] [get_bd_ports CAM1_TRIG] [get_bd_ports CAM2_TRIG] [get_bd_ports CAM0_TRIG]
connect_bd_net [get_bd_pins imu_synchroniser_0/sample_count] [get_bd_pins axi_gpio_0/gpio_io_i]
connect_bd_net [get_bd_pins mipi_dphy_1/rxbyteclkhs] [get_bd_pins fifo_generator_1/wr_clk]
connect_bd_net [get_bd_pins mipi_dphy_2/rxbyteclkhs] [get_bd_pins fifo_generator_2/wr_clk]
connect_bd_net [get_bd_pins mipi_dphy_0/rxbyteclkhs] [get_bd_pins fifo_generator_0/wr_clk]
connect_bd_net [get_bd_pins mipi_dphy_0/dl0_rxdatahs] [get_bd_pins fifo_generator_0/din]
connect_bd_net [get_bd_pins mipi_dphy_0/dl0_rxvalidhs] [get_bd_pins fifo_generator_0/wr_en]
connect_bd_net [get_bd_pins mipi_dphy_2/dl0_rxvalidhs] [get_bd_pins fifo_generator_2/wr_en]
connect_bd_net [get_bd_pins mipi_dphy_1/dl0_rxdatahs] [get_bd_pins fifo_generator_1/din]
connect_bd_net [get_bd_pins mipi_dphy_1/dl0_rxvalidhs] [get_bd_pins fifo_generator_1/wr_en]
connect_bd_net [get_bd_pins fifo_generator_1/valid] [get_bd_pins mipi_image_extractor_1/mipi_data_valid]
connect_bd_net [get_bd_pins fifo_generator_2/valid] [get_bd_pins mipi_image_extractor_2/mipi_data_valid]
connect_bd_net [get_bd_pins fifo_generator_0/valid] [get_bd_pins mipi_image_extractor_0/mipi_data_valid]
connect_bd_net [get_bd_pins mipi_image_extractor_0/line_data] [get_bd_pins ast_detector_0/d]
connect_bd_net [get_bd_pins mipi_image_extractor_0/line_valid] [get_bd_pins ast_detector_0/lv]
connect_bd_net [get_bd_pins mipi_image_extractor_0/frame_valid] [get_bd_pins ast_detector_0/fv]
connect_bd_net [get_bd_pins ast_detector_0/qv] [get_bd_pins mipi_image_extractor_0/corner_data_valid]
connect_bd_net [get_bd_pins ast_detector_0/q] [get_bd_pins mipi_image_extractor_0/corner_data]
connect_bd_net [get_bd_ports DIP_SWITCH] [get_bd_pins xlconcat_1/In0]
connect_bd_net [get_bd_pins axi_gpio_1/gpio_io_o] [get_bd_pins xlslice_0/Din] [get_bd_pins xlslice_1/Din]
connect_bd_net [get_bd_pins xlslice_1/Dout] [get_bd_pins ast_detector_0/en] [get_bd_pins ast_detector_1/en]
connect_bd_net [get_bd_pins xlslice_0/Dout] [get_bd_pins ast_detector_0/t] [get_bd_pins ast_detector_1/t]
connect_bd_net [get_bd_pins mipi_image_extractor_1/line_data] [get_bd_pins ast_detector_1/d]
connect_bd_net [get_bd_pins mipi_image_extractor_1/line_valid] [get_bd_pins ast_detector_1/lv]
connect_bd_net [get_bd_pins mipi_image_extractor_1/frame_valid] [get_bd_pins ast_detector_1/fv]
connect_bd_net [get_bd_pins ast_detector_1/q] [get_bd_pins mipi_image_extractor_1/corner_data]
connect_bd_net [get_bd_pins ast_detector_1/qv] [get_bd_pins mipi_image_extractor_1/corner_data_valid]
connect_bd_net -net GPIO11_1 [get_bd_ports GPIO11] [get_bd_pins zynq_ultra_ps_e_0/emio_uart1_rxd]
connect_bd_net -net GPIO9_1 [get_bd_ports GPIO9] [get_bd_pins zynq_ultra_ps_e_0/emio_spi0_m_i]
connect_bd_net [get_bd_pins zynq_ultra_ps_e_0/emio_uart1_txd] [get_bd_ports GPIO17]
connect_bd_net [get_bd_pins zynq_ultra_ps_e_0/emio_spi0_m_o] [get_bd_ports GPIO15]
connect_bd_net [get_bd_pins zynq_ultra_ps_e_0/emio_spi0_sclk_o] [get_bd_ports GPIO16]
connect_bd_net [get_bd_pins zynq_ultra_ps_e_0/emio_spi0_ss_o_n] [get_bd_ports GPIO13]
connect_bd_net [get_bd_pins xlconcat_1/dout] [get_bd_pins zynq_ultra_ps_e_0/emio_gpio_i]
connect_bd_net -net GPIO8_1 [get_bd_ports GPIO8] [get_bd_pins xlconcat_1/In1]
connect_bd_net [get_bd_pins axi_uartlite_0/tx] [get_bd_ports GPIO7]
connect_bd_net -net GPIO1_1 [get_bd_ports GPIO1] [get_bd_pins axi_uartlite_0/rx]
connect_bd_net [get_bd_pins zynq_ultra_ps_e_0/emio_gpio_o] \
  [get_bd_pins xlslice_2/Din] [get_bd_pins xlslice_3/Din] [get_bd_pins xlslice_5/Din] [get_bd_pins xlslice_4/Din] \
  [get_bd_pins xlslice_6/Din] [get_bd_pins xlslice_7/Din]
connect_bd_net [get_bd_pins xlslice_2/Dout] [get_bd_ports GPIO6]
connect_bd_net [get_bd_pins zynq_ultra_ps_e_0/pl_clk2] \
  [get_bd_pins axi_uartlite_0/s_axi_aclk] [get_bd_pins ps8_0_axi_periph/M08_ACLK] \
  [get_bd_pins rst_ps8_0_159M/slowest_sync_clk]
connect_bd_net [get_bd_pins rst_ps8_0_159M/peripheral_aresetn] [get_bd_pins axi_uartlite_0/s_axi_aresetn] [get_bd_pins ps8_0_axi_periph/M08_ARESETN]
connect_bd_net [get_bd_pins axi_uartlite_0/interrupt] [get_bd_pins xlconcat_0/In7]
connect_bd_net -net GPIO0_1 [get_bd_ports GPIO0] [get_bd_pins xlconcat_1/In2]
connect_bd_net -net GPIO2_1 [get_bd_ports GPIO2] [get_bd_pins xlconcat_1/In3]
connect_bd_net -net GPIO3_1 [get_bd_ports GPIO3] [get_bd_pins xlconcat_1/In4]
connect_bd_net [get_bd_pins xlslice_3/Dout] [get_bd_ports GPIO4]
connect_bd_net [get_bd_pins xlslice_4/Dout] [get_bd_ports GPIO5]
connect_bd_net [get_bd_pins xlslice_5/Dout] [get_bd_ports GPIO10]
connect_bd_net [get_bd_pins xlslice_6/Dout] [get_bd_ports GPIO12]
connect_bd_net [get_bd_pins zynq_ultra_ps_e_0/emio_gpio_t] [get_bd_pins xlslice_8/Din]
connect_bd_net [get_bd_pins xlslice_8/Dout] [get_bd_pins util_ds_buf_0/IOBUF_IO_T]
connect_bd_net [get_bd_pins xlslice_7/Dout] [get_bd_pins util_ds_buf_0/IOBUF_IO_I]
connect_bd_net [get_bd_pins util_ds_buf_0/IOBUF_IO_O] [get_bd_pins xlconcat_1/In6]
connect_bd_net [get_bd_ports AUX] [get_bd_pins util_ds_buf_0/IOBUF_IO_IO]

# ---- address map ----
assign_bd_address -offset 0x00000000 -range 2G -target_address_space [get_bd_addr_spaces axi_vdma_0/Data_S2MM] [get_bd_addr_segs zynq_ultra_ps_e_0/SAXIGP2/HP0_DDR_LOW]
assign_bd_address -offset 0xC0000000 -range 512M -target_address_space [get_bd_addr_spaces axi_vdma_0/Data_S2MM] [get_bd_addr_segs zynq_ultra_ps_e_0/SAXIGP2/HP0_QSPI]
exclude_bd_addr_seg -offset 0xFF000000 -range 16M -target_address_space [get_bd_addr_spaces axi_vdma_0/Data_S2MM] [get_bd_addr_segs zynq_ultra_ps_e_0/SAXIGP2/HP0_LPS_OCM]
assign_bd_address -offset 0x00000000 -range 2G -target_address_space [get_bd_addr_spaces axi_vdma_1/Data_S2MM] [get_bd_addr_segs zynq_ultra_ps_e_0/SAXIGP2/HP0_DDR_LOW]
assign_bd_address -offset 0xC0000000 -range 512M -target_address_space [get_bd_addr_spaces axi_vdma_1/Data_S2MM] [get_bd_addr_segs zynq_ultra_ps_e_0/SAXIGP2/HP0_QSPI]
exclude_bd_addr_seg -offset 0xFF000000 -range 16M -target_address_space [get_bd_addr_spaces axi_vdma_1/Data_S2MM] [get_bd_addr_segs zynq_ultra_ps_e_0/SAXIGP2/HP0_LPS_OCM]
assign_bd_address -offset 0x00000000 -range 2G -target_address_space [get_bd_addr_spaces axi_vdma_2/Data_S2MM] [get_bd_addr_segs zynq_ultra_ps_e_0/SAXIGP2/HP0_DDR_LOW]
assign_bd_address -offset 0xC0000000 -range 512M -target_address_space [get_bd_addr_spaces axi_vdma_2/Data_S2MM] [get_bd_addr_segs zynq_ultra_ps_e_0/SAXIGP2/HP0_QSPI]
exclude_bd_addr_seg -offset 0xFF000000 -range 16M -target_address_space [get_bd_addr_spaces axi_vdma_2/Data_S2MM] [get_bd_addr_segs zynq_ultra_ps_e_0/SAXIGP2/HP0_LPS_OCM]
assign_bd_address -offset 0x0080000000 -range 4K -target_address_space [get_bd_addr_spaces zynq_ultra_ps_e_0/Data] [get_bd_addr_segs axi_vdma_0/S_AXI_LITE/Reg]
assign_bd_address -offset 0x0080001000 -range 4K -target_address_space [get_bd_addr_spaces zynq_ultra_ps_e_0/Data] [get_bd_addr_segs axi_vdma_1/S_AXI_LITE/Reg]
assign_bd_address -offset 0x0080002000 -range 4K -target_address_space [get_bd_addr_spaces zynq_ultra_ps_e_0/Data] [get_bd_addr_segs axi_vdma_2/S_AXI_LITE/Reg]
assign_bd_address -offset 0x0080003000 -range 4K -target_address_space [get_bd_addr_spaces zynq_ultra_ps_e_0/Data] [get_bd_addr_segs axi_iic_0/S_AXI/Reg]
assign_bd_address -offset 0x0080004000 -range 4K -target_address_space [get_bd_addr_spaces zynq_ultra_ps_e_0/Data] [get_bd_addr_segs axi_iic_1/S_AXI/Reg]
assign_bd_address -offset 0x0080005000 -range 4K -target_address_space [get_bd_addr_spaces zynq_ultra_ps_e_0/Data] [get_bd_addr_segs axi_iic_2/S_AXI/Reg]
assign_bd_address -offset 0x0080006000 -range 4K -target_address_space [get_bd_addr_spaces zynq_ultra_ps_e_0/Data] [get_bd_addr_segs axi_gpio_0/S_AXI/Reg]
assign_bd_address -offset 0x0080007000 -range 4K -target_address_space [get_bd_addr_spaces zynq_ultra_ps_e_0/Data] [get_bd_addr_segs axi_gpio_1/S_AXI/Reg]
assign_bd_address -offset 0x0080008000 -range 4K -target_address_space [get_bd_addr_spaces zynq_ultra_ps_e_0/Data] [get_bd_addr_segs axi_uartlite_0/S_AXI/Reg]

validate_bd_design
save_bd_design
